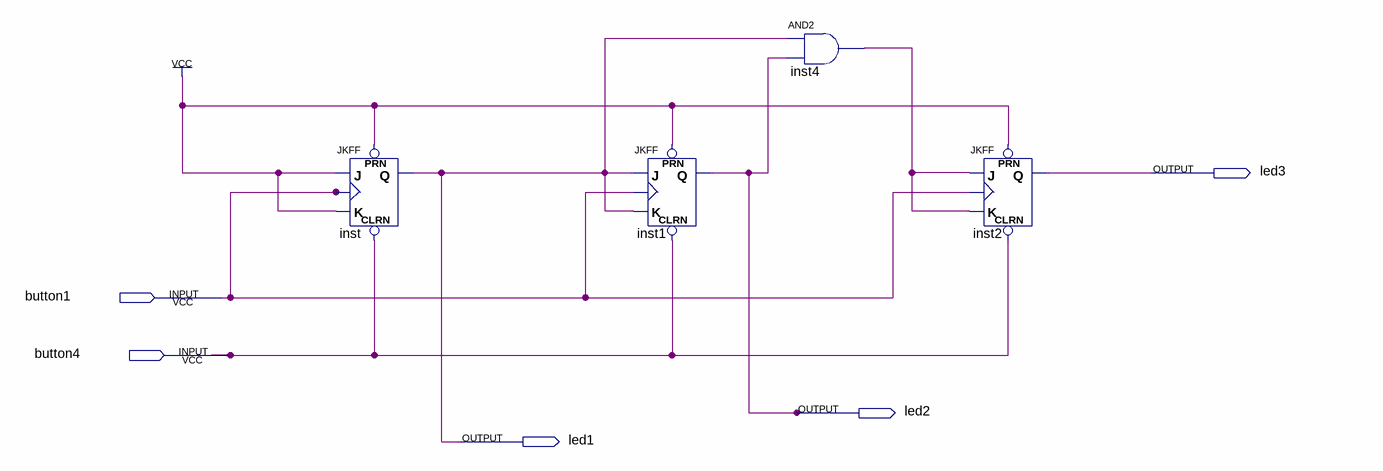
[diagram p0: schematic sheet]
// Quartus schematic Counter_3bit.bdf as structural Verilog: 4 symbols, 5 pins
module Counter_3bit (
  input  button1,
  input  button4,
  output led3,
  output led2,
  output led1
);

  wire inst4_out;

  JKFF inst (.PRN(1'b1), .CLRN(button4), .K(1'b1), .J(1'b1), .CLK(button1), .Q(led1));
  JKFF inst1 (.PRN(1'b1), .CLRN(button4), .K(led1), .J(led1), .CLK(button1), .Q(led2));
  and inst4 (inst4_out, led1, led2);
  JKFF inst2 (.PRN(1'b1), .CLRN(button4), .K(inst4_out), .J(inst4_out), .CLK(button1), .Q(led3));
endmodule
